# Altium schematic sheet connectors&drivers.SchDoc
size A4; SheetNumber: 7; SheetTotal: 7
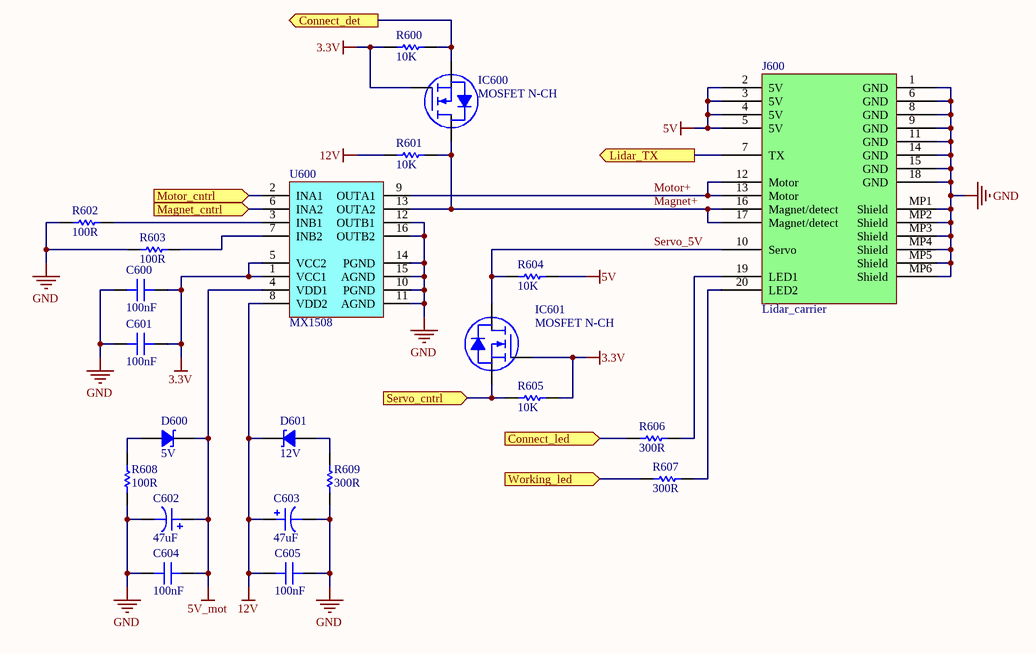
[diagram p0: connectors&drivers.SchDoc]

## Parts
C600  100nF  [CAP 0603]
C601  100nF  [CAP 0603]
C602  47uF  [CAP ALSMD ELEC 6.6MM H5.7MM]
C603  47uF  [CAP ALSMD ELEC 6.6MM H5.7MM]
C604  100nF  [CAP 0603]
C605  100nF  [CAP 0603]
D600  5V  [Bourns DO214AC SMA]
D601  12V  [Bourns DO214AC SMA]
IC600  MOSFET N-CH  [SOT-23]
IC601  MOSFET N-CH  [SOT-23]
J600  Lidar_carrier  [2167010209]
R600  10K  [RES 0603]
R601  10K  [RES 0603]
R602  100R  [RES 0603]
R603  100R  [RES 0603]
R604  10K  [RES 0603]
R605  10K  [RES 0603]
R606  300R  [RES 0603]
R607  300R  [RES 0603]
R608  100R  [RES 1206]
R609  300R  [RES 1206]
U600  MX1508  [TI SOP-16 D]

## Ports
Connect_det (out, see Main_scheme[2B]), Connect_led (in, see Main_scheme[2B]), Lidar_TX (out, see Main_scheme[2A]), Magnet_cntrl (in, see Main_scheme[3A]), Motor_cntrl (in, see Main_scheme[2A]), Servo_cntrl (in, see Main_scheme[3A]), Working_led (in, see Main_scheme[2B])

## Nets
3.3V: C600.2 C601.2 IC600.1(G) IC601.1(G) R600.2 R605.1 U600.1(VCC1) U600.5(VCC2)
5V: J600.2(5V) J600.3(5V) J600.4(5V) J600.5(5V) R604.1
5V_mot: C602.2 C604.2 D600.2 U600.4(VDD1)
12V: C603.2 C605.1 D601.2 R601.2 U600.8(VDD2)
GND: C600.1 C601.1 C602.1 C603.1 C604.1 C605.2 J600.1(GND) J600.6(GND) J600.8(GND) J600.9(GND) J600.11(GND) J600.14(GND) J600.15(GND) J600.18(GND) J600.MP1(Shield) J600.MP2(Shield) J600.MP3(Shield) J600.MP4(Shield) J600.MP5(Shield) J600.MP6(Shield) R602.1 R603.1 R608.1 R609.1 U600.10(PGND) U600.11(AGND) U600.12(OUTB1) U600.14(PGND) U600.15(AGND) U600.16(OUTB2)
Connect_det: IC600.2(S) R600.1 ; port Connect_det
Connect_led: R606.2 ; port Connect_led
Lidar_TX: J600.7(TX) ; port Lidar_TX
Magnet+: IC600.3(D) J600.16(Magnet/detect) J600.17(Magnet/detect) R601.1 U600.13(OUTA2)
Magnet_cntrl: U600.6(INA2) ; port Magnet_cntrl
Motor+: J600.12(Motor) J600.13(Motor) U600.9(OUTA1)
Motor_cntrl: U600.2(INA1) ; port Motor_cntrl
Servo_5V: IC601.3(D) J600.10(Servo) R604.2
Servo_cntrl: IC601.2(S) R605.2 ; port Servo_cntrl
Working_led: R607.2 ; port Working_led
NetD600_1: D600.1 R608.2
NetD601_1: D601.1 R609.2
NetJ600_19: J600.19(LED1) R606.1
NetJ600_20: J600.20(LED2) R607.1
NetR602_2: R602.2 U600.3(INB1)
NetR603_2: R603.2 U600.7(INB2)

## Library data of the parts
C600 C601 C604 C605 = Capacitor: SMT Capacitor; Value: 100nF
C602 C603 = Capacitor polarized: SMT Polarised Capacitor; Value: 47uF
D600 D601 = Diode Zener: Zener Diode
  D600: Value: 5V
  D601: Value: 12V
R600-R609 = Res: Resistor; Ordered by: Subcon; Published: 8-Jun-2000; Revision: July-2002: Re-released for DXP Platform.; Publisher: Altium Limited
  R600 R601 R604 R605: Value: 10K
  R602 R603 R608: Value: 100R
  R606 R607 R609: Value: 300R